# Altium project STM32F1_CNC_HW.PrjPcb
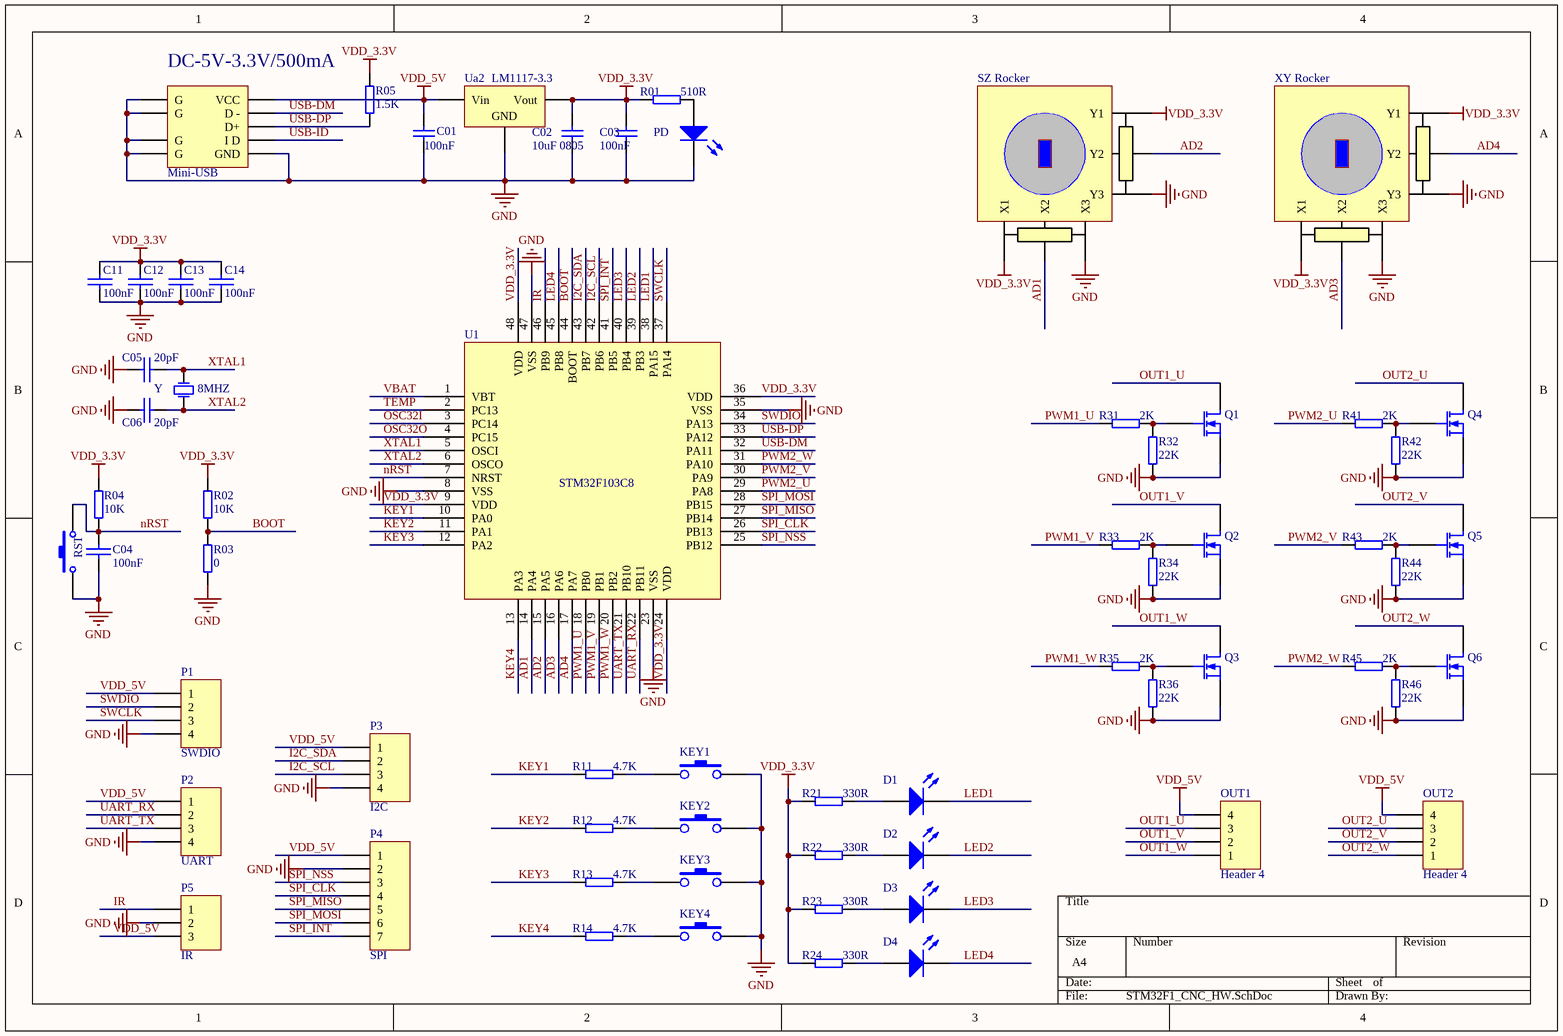
[diagram p0: STM32F1_CNC_HW.SchDoc]
1 sheet, 64 parts. Net scope: global (net labels, ports and power ports of the same name join across sheets).
Board files: STM32F1_CNC_HW.PcbDoc, logo.PcbDoc, logo2.PcbDoc

## Sheet STM32F1_CNC_HW.SchDoc
size A4

### Parts
C01  100nF  [0805]
C02  10uF 0805  [0805]
C03  100nF  [0603]
C04  100nF  [0603]
C05  20pF  [0603]
C06  20pF  [0603]
C11  100nF  [0603]
C12  100nF  [0603]
C13  100nF  [0603]
C14  100nF  [0603]
D1  LED0  [LED-0603]  (value not drawn)
D2  LED0  [LED-0603]  (value not drawn)
D3  LED0  [LED-0603]  (value not drawn)
D4  LED0  [LED-0603]  (value not drawn)
KEY1  微动开关  [KeyB-6*6]  (value not drawn)
KEY2  微动开关  [KeyB-6*6]  (value not drawn)
KEY3  微动开关  [KeyB-6*6]  (value not drawn)
KEY4  微动开关  [KeyB-6*6]  (value not drawn)
Mini-USB  Mini-USB  [USB-mini-S]  (value not drawn)
OUT1  Header 4  [HDR-2.54-4P]
OUT2  Header 4  [HDR-2.54-4P]
P1  SWDIO  [HDR-2.54-4P]
P2  UART  [HDR-2.54-4P]
P3  I2C  [HDR-2.54-4P]
P4  SPI  [HDR-2.54-7P]
P5  IR  [IR-HS1838]
PD  LED  [LED-0603]  (value not drawn)
Q1  MOSFET-N  [SOT-23]  (value not drawn)
Q2  MOSFET-N  [SOT-23]  (value not drawn)
Q3  MOSFET-N  [SOT-23]  (value not drawn)
Q4  MOSFET-N  [SOT-23]  (value not drawn)
Q5  MOSFET-N  [SOT-23]  (value not drawn)
Q6  MOSFET-N  [SOT-23]  (value not drawn)
R01  510R  [0603]
R02  10K  [0603]
R03  0  [0603]
R04  10K  [0603]
R05  1.5K  [0603]
R11  4.7K  [0603]
R12  4.7K  [0603]
R13  4.7K  [0603]
R14  4.7K  [0603]
R21  330R  [0603]
R22  330R  [0603]
R23  330R  [0603]
R24  330R  [0603]
R31  2K  [0603]
R32  22K  [0603]
R33  2K  [0603]
R34  22K  [0603]
R35  2K  [0603]
R36  22K  [0603]
R41  2K  [0603]
R42  22K  [0603]
R43  2K  [0603]
R44  22K  [0603]
R45  2K  [0603]
R46  22K  [0603]
RST  SW-PB  [RST-6*6]  (value not drawn)
SZ_Rocker  XY Rocker  [XY Rocker]  (value not drawn)
U1  STM32F103C8  [QFP48]
Ua2  LM1117-3.3  [SOT223]
XY_Rocker  XY Rocker  [XY Rocker]  (value not drawn)
Y  8MHZ  [XTAL-3215-3P]

### Nets
GND: C01.1 C02.2 C03.1 C04.2 C05.1 C06.1 C11.2 C12.2 C13.2 C14.2 KEY1.2 KEY2.2 KEY3.2 KEY4.2 Mini-USB.0(G) Mini-USB.5(GND) P1.4 P2.4 P3.4 P4.2 P5.2 PD.2(K) Q1.2(S) Q2.2(S) Q3.2(S) Q4.2(S) Q5.2(S) Q6.2(S) R03.2 R32.1 R34.1 R36.1 R42.1 R44.1 R46.1 RST.2 SZ_Rocker.X3 SZ_Rocker.Y3 U1.8(VSS) U1.23(VSS) U1.35(VSS) U1.47(VSS) Ua2.1(GND) XY_Rocker.X3 XY_Rocker.Y3
VDD_3.3V: C02.1 C03.2 C11.1 C12.1 C13.1 C14.1 R01.2 R02.1 R04.1 R05.1 R21.1 R22.1 R23.1 R24.1 SZ_Rocker.X1 SZ_Rocker.Y1 U1.9(VDD) U1.24(VDD) U1.36(VDD) U1.48(VDD) Ua2.2(Vout) XY_Rocker.X1 XY_Rocker.Y1
VDD_5V: C01.2 Mini-USB.1(VCC) OUT1.4 OUT2.4 P1.1 P2.1 P3.1 P4.1 P5.3 Ua2.3(Vin)
AD1: SZ_Rocker.X2 U1.14(PA4)
AD2: SZ_Rocker.Y2 U1.15(PA5)
AD3: U1.16(PA6) XY_Rocker.X2
AD4: U1.17(PA7) XY_Rocker.Y2
BOOT: R02.2 R03.1 U1.44(BOOT)
I2C_SCL: P3.3 U1.42(PB6)
I2C_SDA: P3.2 U1.43(PB7)
IR: P5.1 U1.46(PB9)
KEY1: R11.1 U1.10(PA0)
KEY2: R12.1 U1.11(PA1)
KEY3: R13.1 U1.12(PA2)
KEY4: R14.1 U1.13(PA3)
LED1: D1.2(K) U1.38(PA15)
LED2: D2.2(K) U1.39(PB3)
LED3: D3.2(K) U1.40(PB4)
LED4: D4.2(K) U1.45(PB8)
nRST: C04.1 R04.2 RST.1 U1.7(NRST)
OSC32I: U1.3(PC14)
OSC32O: U1.4(PC15)
OUT1_U: OUT1.3 Q1.3(D)
OUT1_V: OUT1.2 Q2.3(D)
OUT1_W: OUT1.1 Q3.3(D)
OUT2_U: OUT2.3 Q4.3(D)
OUT2_V: OUT2.2 Q5.3(D)
OUT2_W: OUT2.1 Q6.3(D)
PWM1_U: R31.1 U1.18(PB0)
PWM1_V: R33.1 U1.19(PB1)
PWM1_W: R35.1 U1.20(PB2)
PWM2_U: R41.1 U1.29(PA8)
PWM2_V: R43.1 U1.30(PA9)
PWM2_W: R45.1 U1.31(PA10)
SPI_CLK: P4.4 U1.26(PB13)
SPI_INT: P4.7 U1.41(PB5)
SPI_MISO: P4.5 U1.27(PB14)
SPI_MOSI: P4.6 U1.28(PB15)
SPI_NSS: P4.3 U1.25(PB12)
SWCLK: P1.3 U1.37(PA14)
SWDIO: P1.2 U1.34(PA13)
TEMP: U1.2(PC13)
UART_RX: P2.2 U1.22(PB11)
UART_TX: P2.3 U1.21(PB10)
USB-DM: Mini-USB.2(D_-) U1.32(PA11)
USB-DP: Mini-USB.3(D+) R05.2 U1.33(PA12)
USB-ID: Mini-USB.4(I_D)
VBAT: U1.1(VBT)
XTAL1: C05.2 U1.5(OSCI) Y.3(OSC2)
XTAL2: C06.2 U1.6(OSCO) Y.1(OSC1)
NetD1_1: D1.1(A) R21.2
NetD2_1: D2.1(A) R22.2
NetD3_1: D3.1(A) R23.2
NetD4_1: D4.1(A) R24.2
NetKEY1_1: KEY1.1 R11.2
NetKEY2_1: KEY2.1 R12.2
NetKEY3_1: KEY3.1 R13.2
NetKEY4_1: KEY4.1 R14.2
NetPD_1: PD.1(A) R01.1
NetQ1_1: Q1.1(G) R31.2 R32.2
NetQ2_1: Q2.1(G) R33.2 R34.2
NetQ3_1: Q3.1(G) R35.2 R36.2
NetQ4_1: Q4.1(G) R41.2 R42.2
NetQ5_1: Q5.1(G) R43.2 R44.2
NetQ6_1: Q6.1(G) R45.2 R46.2

### Notes on the sheet
- (near Mini-USB) DC-5V-3.3V/500mA

### Library data of the parts
C01 = CAP SMD 0603  X5R 1礔 25V 10%: 0603  X5R; Value: 1礔; Rated voltage: 25V; Tolerance: 10%; Manufacturer: *; Manufacturer P/N: *; Order code Farnell: 1288202RL; Power: *; Technology: X5R; Temperature  Factor: *; Temperature Max: +125癈; Temperature Min: -55癈; STS Code: *
C02 = CAP SMD 0603  X5R 1礔 25V 10%: 0603  X5R 1礔; Rated voltage: 25V; Tolerance: 10%; Manufacturer: *; Manufacturer P/N: *; Order code Farnell: 1288202RL; Value: 1礔; Power: *; Technology: X5R; Temperature  Factor: *; Temperature Max: +125癈; Temperature Min: -55癈; STS Code: *
C03 = Capacitor_ST: Capacitor 0402 / 0603 / 0805; Revision: July-2002: Re-released for DXP Platform.; Value: 100nF
C04 C05 C06 C11-C14 = CAP: Capacitor
  C04 C11-C14: value: 100nF
  C05 C06: value: 20pF
D1-D4 = LED0: Typical INFRARED GaAs LED; Published: 8-Jun-2000; LatestRevisionDate: 08-Jul-2005; LatestRevisionNote: Mech Layer 1 removed.; PackageReference: LED-0; Publisher: Altium Limited; PackageDescription: LED; 2 Leads
Mini-USB = Mini-USB_G
OUT1 OUT2 P1-P3 = Header 4: Header, 4-Pin; LatestRevisionDate: 17-Jul-2002; LatestRevisionNote: Re-released for DXP Platform.; Publisher: Altium Limited
P4 = Header 7: Header, 7-Pin; LatestRevisionDate: 17-Jul-2002; LatestRevisionNote: Re-released for DXP Platform.; Publisher: Altium Limited
P5 = Header 3: Header, 3-Pin; LatestRevisionDate: 17-Jul-2002; LatestRevisionNote: Re-released for DXP Platform.; Publisher: Altium Limited
PD = LED2: Typical RED, GREEN, YELLOW, AMBER GaAs LED; Published: 8-Jun-2000; LatestRevisionDate: 17-Jul-2002; LatestRevisionNote: Re-released for DXP Platform.; PackageVersion: Feb-2002; PackageReference: 3.2X1.6X1.1; Publisher: Altium Limited; PackageDescription: SM LED; 2 Flat Leads
Q1-Q6 = MOSFET-N: N-Channel MOSFET; Published: 8-Jun-2000; LatestRevisionDate: 17-Jul-2002; LatestRevisionNote: Re-released for DXP Platform.; PackageVersion: 1995/1996; PackageReference: E3; Publisher: Altium Limited; PackageDescription: TO, Flat Index; 3 In-Line, Axial Leads; Body Dia. 4.6mm; Lead Dia. 0.5 mm (max)
R01 R02 R03 R04 R05 R11-R14 R21-R24 R31-R36 R41-R46 = RES1: Resister
  R04: value: 10K
  R05: value: 1.5K
RST = SW-PB: Switch; Published: 24-Mar-1999; LatestRevisionDate: 17-Jul-2002; LatestRevisionNote: Re-released for DXP Platform.; PackageReference: SPST-2; Publisher: Altium Limited; PackageDescription: Switch; 2 Leads
Ua2 = Volt Reg: Voltage Regulator; Published: 24-Mar-1999; LatestRevisionDate: 29-May-2009; LatestRevisionNote: IPC-7351 Footprint Added.; PackageReference: D2PAK; Publisher: Altium Limited; PackageDescription: 3-Pin Transistor Outline Package 2.54 mm Pitch, 15.1 mm Lead Span
Y = ECS-10-13-1: Crystal Oscillator; Published: 17-Jul-2002; Datasheet: Latest Revision: 18-Apr-2000; Publisher: Altium Limited